# Altium schematic sheet TECS_DRIVER.SchDoc: TEC_DRIVER
size 420 x 297 mm; SheetNumber: 6; SheetTotal: 11
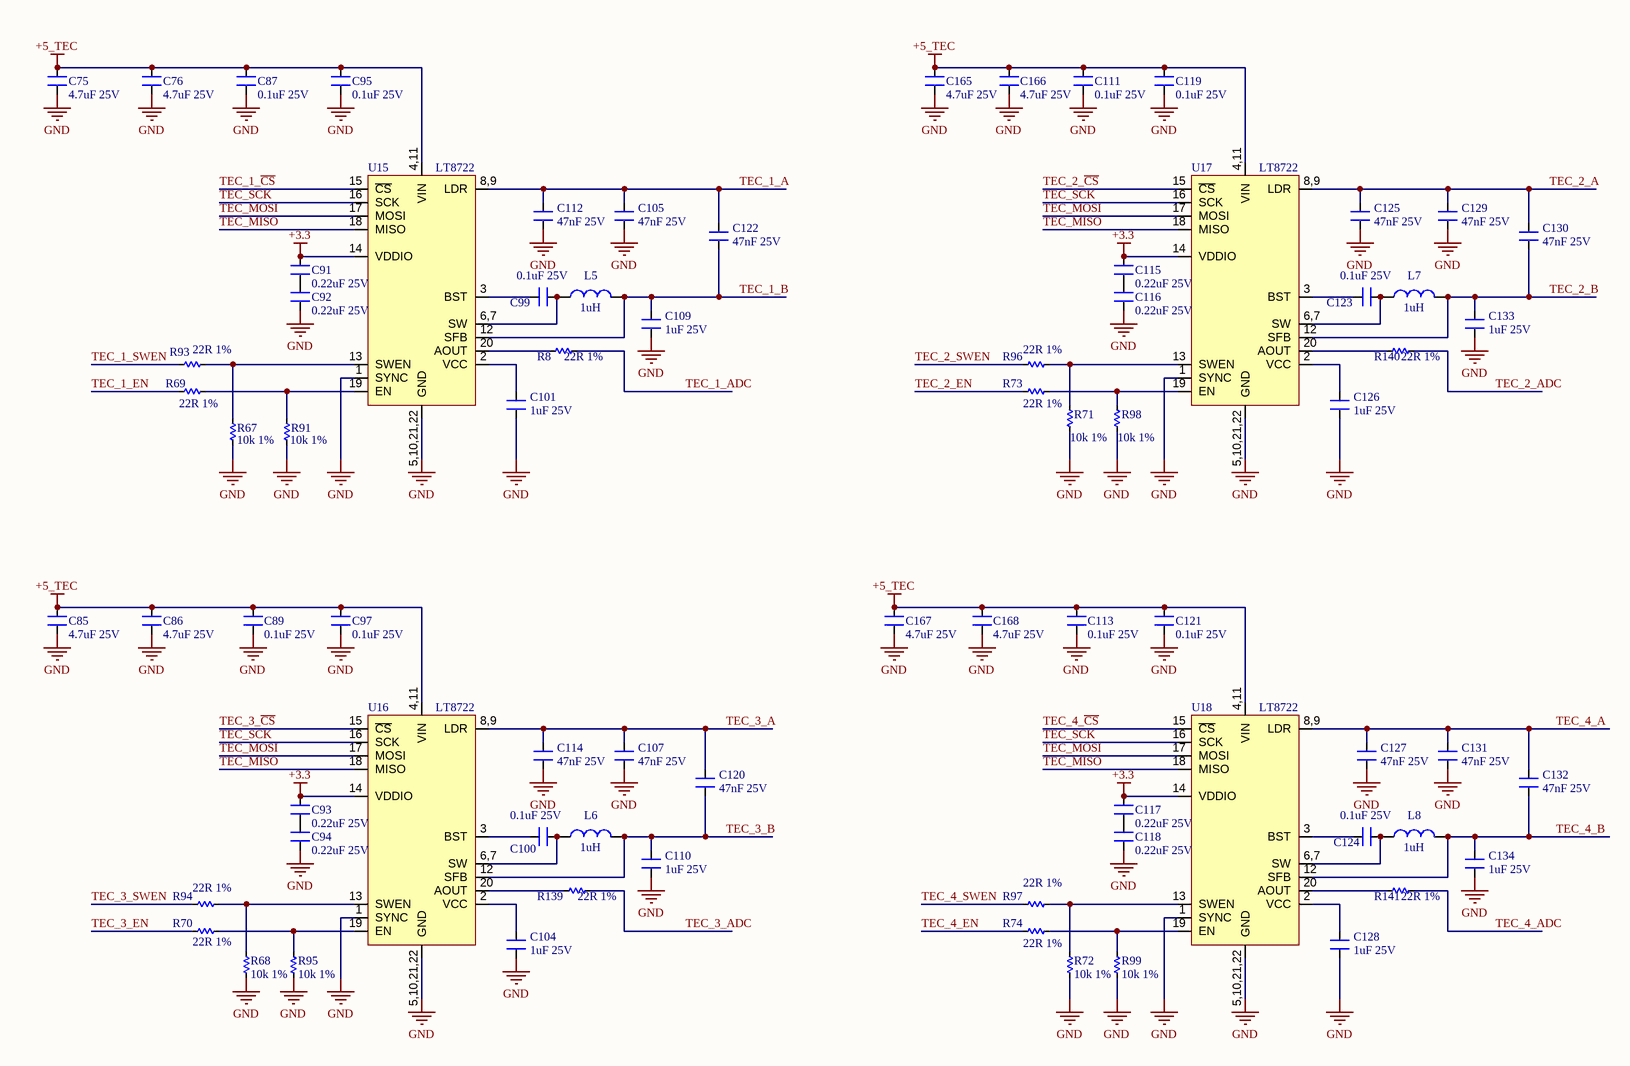
[diagram p0: TECS_DRIVER.SchDoc]

## Parts
C75  4.7uF 25V  [CN-SMD-0603]
C76  4.7uF 25V  [CN-SMD-0603]
C85  4.7uF 25V  [CN-SMD-0603]
C86  4.7uF 25V  [CN-SMD-0603]
C87  0.1uF 25V  [CN-SMD-0603]
C89  0.1uF 25V  [CN-SMD-0603]
C91  0.22uF 25V  [CN-SMD-0603]
C92  0.22uF 25V  [CN-SMD-0603]
C93  0.22uF 25V  [CN-SMD-0603]
C94  0.22uF 25V  [CN-SMD-0603]
C95  0.1uF 25V  [CN-SMD-0603]
C97  0.1uF 25V  [CN-SMD-0603]
C99  0.1uF 25V  [CN-SMD-0603]
C100  0.1uF 25V  [CN-SMD-0603]
C101  1uF 25V  [CN-SMD-0603]
C104  1uF 25V  [CN-SMD-0603]
C105  47nF 25V  [CN-SMD-0603]
C107  47nF 25V  [CN-SMD-0603]
C109  1uF 25V  [CN-SMD-0603]
C110  1uF 25V  [CN-SMD-0603]
C111  0.1uF 25V  [CN-SMD-0603]
C112  47nF 25V  [CN-SMD-0603]
C113  0.1uF 25V  [CN-SMD-0603]
C114  47nF 25V  [CN-SMD-0603]
C115  0.22uF 25V  [CN-SMD-0603]
C116  0.22uF 25V  [CN-SMD-0603]
C117  0.22uF 25V  [CN-SMD-0603]
C118  0.22uF 25V  [CN-SMD-0603]
C119  0.1uF 25V  [CN-SMD-0603]
C120  47nF 25V  [CN-SMD-0603]
C121  0.1uF 25V  [CN-SMD-0603]
C122  47nF 25V  [CN-SMD-0603]
C123  0.1uF 25V  [CN-SMD-0603]
C124  0.1uF 25V  [CN-SMD-0603]
C125  47nF 25V  [CN-SMD-0603]
C126  1uF 25V  [CN-SMD-0603]
C127  47nF 25V  [CN-SMD-0603]
C128  1uF 25V  [CN-SMD-0603]
C129  47nF 25V  [CN-SMD-0603]
C130  47nF 25V  [CN-SMD-0603]
C131  47nF 25V  [CN-SMD-0603]
C132  47nF 25V  [CN-SMD-0603]
C133  1uF 25V  [CN-SMD-0603]
C134  1uF 25V  [CN-SMD-0603]
C165  4.7uF 25V  [CN-SMD-0603]
C166  4.7uF 25V  [CN-SMD-0603]
C167  4.7uF 25V  [CN-SMD-0603]
C168  4.7uF 25V  [CN-SMD-0603]
L5  1uH  [L-SMD-M-3.5x3.5x2mm]
L6  1uH  [L-SMD-M-3.5x3.5x2mm]
L7  1uH  [L-SMD-M-3.5x3.5x2mm]
L8  1uH  [L-SMD-M-3.5x3.5x2mm]
R8  22R 1%  [RES-SMD-0603]
R67  10k 1%  [RES-SMD-0603]
R68  10k 1%  [RES-SMD-0603]
R69  22R 1%  [RES-SMD-0603]
R70  22R 1%  [RES-SMD-0603]
R71  10k 1%  [RES-SMD-0603]
R72  10k 1%  [RES-SMD-0603]
R73  22R 1%  [RES-SMD-0603]
R74  22R 1%  [RES-SMD-0603]
R91  10k 1%  [RES-SMD-0603]
R93  22R 1%  [RES-SMD-0603]
R94  22R 1%  [RES-SMD-0603]
R95  10k 1%  [RES-SMD-0603]
R96  22R 1%  [RES-SMD-0603]
R97  22R 1%  [RES-SMD-0603]
R98  10k 1%  [RES-SMD-0603]
R99  10k 1%  [RES-SMD-0603]
R139  22R 1%  [RES-SMD-0603]
R140  22R 1%  [RES-SMD-0603]
R141  22R 1%  [RES-SMD-0603]
U15  LT8722  [QFN18]
U16  LT8722  [QFN18]
U17  LT8722  [QFN18]
U18  LT8722  [QFN18]

## Nets
+3.3: C91.2 C93.2 C115.2 C117.2 U15.14(VDDIO) U16.14(VDDIO) U17.14(VDDIO) U18.14(VDDIO)
+5_TEC: C75.2 C76.2 C85.2 C86.2 C87.2 C89.2 C95.2 C97.2 C111.2 C113.2 C119.2 C121.2 C165.2 C166.2 C167.2 C168.2 U15.4,11(VIN) U16.4,11(VIN) U17.4,11(VIN) U18.4,11(VIN)
GND: C75.1 C76.1 C85.1 C86.1 C87.1 C89.1 C92.1 C94.1 C95.1 C97.1 C101.1 C104.1 C105.1 C107.1 C109.1 C110.1 C111.1 C112.1 C113.1 C114.1 C116.1 C118.1 C119.1 C121.1 C125.1 C126.1 C127.1 C128.1 C129.1 C131.1 C133.1 C134.1 C165.1 C166.1 C167.1 C168.1 R67.2 R68.1 R71.2 R72.1 R91.2 R95.1 R98.2 R99.1 U15.1(SYNC) U15.5,10,21,22(GND) U16.1(SYNC) U16.5,10,21,22(GND) U17.1(SYNC) U17.5,10,21,22(GND) U18.1(SYNC) U18.5,10,21,22(GND)
TEC_1_A: C105.2 C112.2 C122.2 U15.8,9(LDR)
TEC_1_ADC: R8.2
TEC_1_B: C109.2 C122.1 L5.2 U15.12(SFB)
TEC_1_~{CS}: U15.15(~{CS})
TEC_1_EN: R69.1
TEC_1_SWEN: R93.1
TEC_2_A: C125.2 C129.2 C130.2 U17.8,9(LDR)
TEC_2_ADC: R140.2
TEC_2_B: C130.1 C133.2 L7.2 U17.12(SFB)
TEC_2_~{CS}: U17.15(~{CS})
TEC_2_EN: R73.1
TEC_2_SWEN: R96.1
TEC_3_A: C107.2 C114.2 C120.2 U16.8,9(LDR)
TEC_3_ADC: R139.2
TEC_3_B: C110.2 C120.1 L6.2 U16.12(SFB)
TEC_3_~{CS}: U16.15(~{CS})
TEC_3_EN: R70.1
TEC_3_SWEN: R94.1
TEC_4_A: C127.2 C131.2 C132.2 U18.8,9(LDR)
TEC_4_ADC: R141.2
TEC_4_B: C132.1 C134.2 L8.2 U18.12(SFB)
TEC_4_~{CS}: U18.15(~{CS})
TEC_4_EN: R74.1
TEC_4_SWEN: R97.1
TEC_MISO: U15.18(MISO) U16.18(MISO) U17.18(MISO) U18.18(MISO)
TEC_MOSI: U15.17(MOSI) U16.17(MOSI) U17.17(MOSI) U18.17(MOSI)
TEC_SCK: U15.16(SCK) U16.16(SCK) U17.16(SCK) U18.16(SCK)
NetC91_1: C91.1 C92.2
NetC93_1: C93.1 C94.2
NetC99_1: C99.1 L5.1 U15.6,7(SW)
NetC99_2: C99.2 U15.3(BST)
NetC100_1: C100.1 L6.1 U16.6,7(SW)
NetC100_2: C100.2 U16.3(BST)
NetC101_2: C101.2 U15.2(VCC)
NetC104_2: C104.2 U16.2(VCC)
NetC115_1: C115.1 C116.2
NetC117_1: C117.1 C118.2
NetC123_1: C123.1 L7.1 U17.6,7(SW)
NetC123_2: C123.2 U17.3(BST)
NetC124_1: C124.1 L8.1 U18.6,7(SW)
NetC124_2: C124.2 U18.3(BST)
NetC126_2: C126.2 U17.2(VCC)
NetC128_2: C128.2 U18.2(VCC)
NetR8_1: R8.1 U15.20(AOUT)
NetR67_1: R67.1 R93.2 U15.13(SWEN)
NetR68_2: R68.2 R94.2 U16.13(SWEN)
NetR69_2: R69.2 R91.1 U15.19(EN)
NetR70_2: R70.2 R95.2 U16.19(EN)
NetR71_1: R71.1 R96.2 U17.13(SWEN)
NetR72_2: R72.2 R97.2 U18.13(SWEN)
NetR73_2: R73.2 R98.1 U17.19(EN)
NetR74_2: R74.2 R99.2 U18.19(EN)
NetR139_1: R139.1 U16.20(AOUT)
NetR140_1: R140.1 U17.20(AOUT)
NetR141_1: R141.1 U18.20(AOUT)

## Notes on the sheet
- Project:
- BEE-PC1
- Sub-system:
- NANORACK_EXP_CONTROLLER
- Design by:
- SANG HUYNH
- BAO BUI Q.
- Sheet title:
- Sheet
- A3
- of
- Checked by:
- Approved by:
- VU PHAM
- Revision:
- Document No:
- V1.0.0
- Size:
- Date:
- 01/10/2024

## Library data of the parts
C75 C76 C85-C87 C89 C91-C95 C97 C99-C101 C104 C105 C107 C109-C134 C165-C168 = Capacitors: Value: 33pF
L5-L8 = L-SMD-1: partNo: 78477010; Manufacturer: Wurth Elektronik; Inductance: 1.0 μH; ComponentLink1Description: Manufacturer; ComponentLink1URL: http://www.we-online.de; Created by: Baojun Chen; Created Date: Nov.2015; ComponentLink2Description: Datasheet; ComponentLink2URL: http://katalog.we-online.de/pbs/datasheet/78477010.pdf
R8 R67-R74 R91 R93-R99 R139-R141 = Res SMD: SMD; Manufacturer: Generic Components; Class: Passive; Published: 08/06/2000; Publisher: Altium Hobart Technology Centre